# EAGLE design schema (EAGLE 8.2.1)
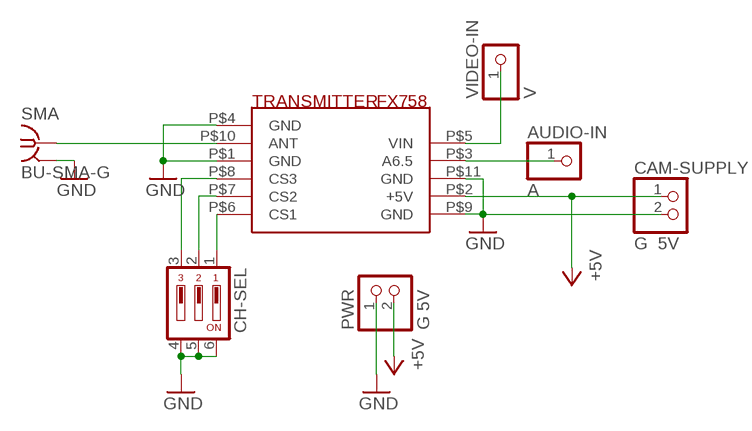
[diagram p0: schematic, sheet 1]

## Parts
AUDIO-IN  A  PINHD-1X1  [1X01]
CAM-SUPPLY  G 5V  PINHD-1X2  [1X02]
CH-SEL  DP03  [DP-03]
PWR  G 5V  PINHD-1X2  [1X02]
SMA  BU-SMA-G  [BU-SMA-G]
TRANSMITTER  FX758  [FX758]
VIDEO-IN  V  PINHD-1X1  [1X01]

## Nets
+5V: CAM-SUPPLY.1 PWR.2 TRANSMITTER.P$2(+5V)
ANTENA: SMA.1 TRANSMITTER.P$10(ANT)
AUDIO-IN: AUDIO-IN.1 TRANSMITTER.P$3(A6.5)
CH1: CH-SEL.1 TRANSMITTER.P$6(CS1)
CH2: CH-SEL.2 TRANSMITTER.P$7(CS2)
CH3: CH-SEL.3 TRANSMITTER.P$8(CS3)
GND: CAM-SUPPLY.2 CH-SEL.4 CH-SEL.5 CH-SEL.6 PWR.1 SMA.2 SMA.3 SMA.4 SMA.5 TRANSMITTER.P$1(GND) TRANSMITTER.P$4(GND) TRANSMITTER.P$9(GND) TRANSMITTER.P$11(GND)
VIDEO-IN: TRANSMITTER.P$5(VIN) VIDEO-IN.1

## Library data of the parts
AUDIO-IN VIDEO-IN = pinhead:PINHD-1X1: PIN HEADER
CAM-SUPPLY PWR = pinhead:PINHD-1X2: PIN HEADER
CH-SEL = switch-dil:DP03: DIL/CODE SWITCH; MPN: MCDP03; OC_FARNELL: 1522004; OC_NEWARK: 74M2976
SMA = con-coax:BU-SMA-G: FEMALE SMA CONNECTOR Radiall distributor RS 193-9117; OC_FARNELL: unknown; OC_NEWARK: unknown
TRANSMITTER = custom-parts:FX758: FX758-2 5.8G 200mW 32CH FPV Wireless Audio Video AV Transmitter Module Factory number: FXT758-2 Voltage: 5V Power: 200mW Frequency: 5725MHz-5945MHz Size: 22x19 mm Modulation type: FM Working temperature: -10℃- +60℃ Transmission frequency group: A: Ch1:5725MHz Ch2:5745MHz Ch3:5765MHz Ch4:5785MHz Ch5:5805MHz Ch6:5825MHz Ch7:5845MHz Ch8:5865MHz B: Ch1:5733MHz Ch2:5752MHz Ch3:5771MHz Ch4:5790MHz Ch5:5809MHz Ch6:5828MHz Ch7:5847MHz Ch8:5866MHz C: Ch1:5645MHz Ch2:5665MHz Ch3:5685MHz Ch4:5705MHz Ch5:5885MHz Ch6:5905MHz Ch7:5925MHz Ch8:5945MHz

## Board
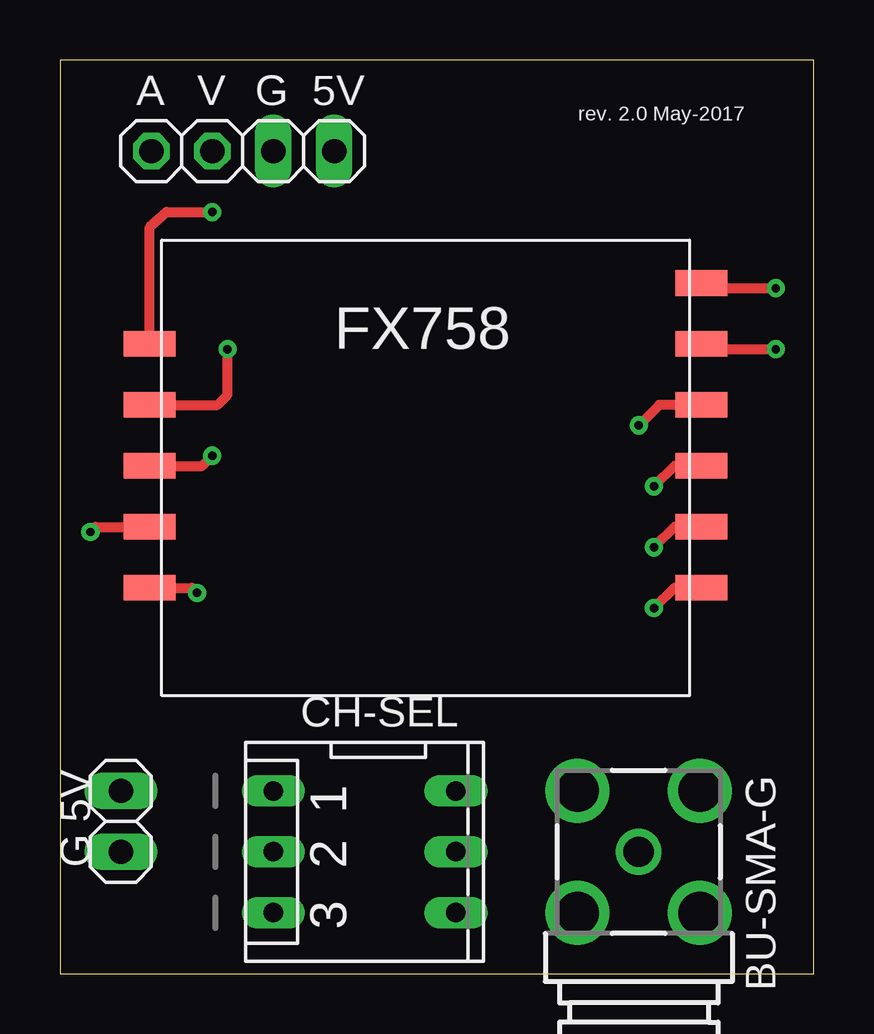
[diagram p1: board, top side]
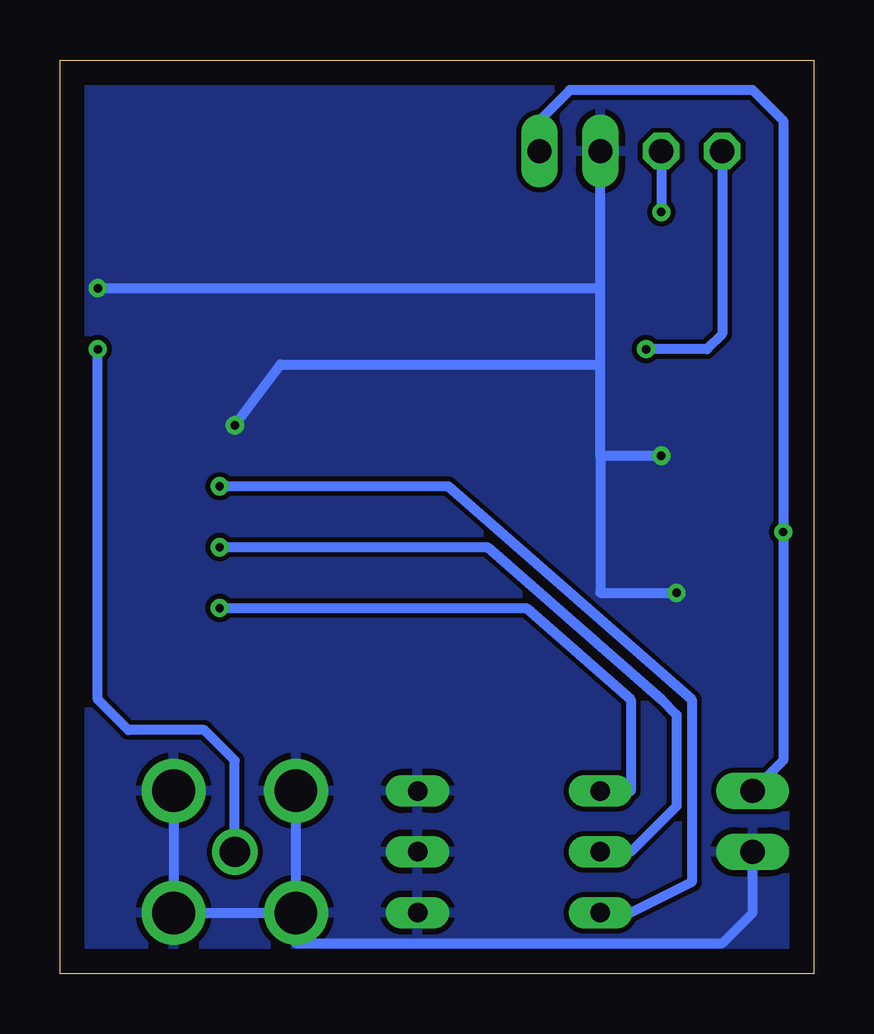
[diagram p2: board, bottom side, seen from below]

Size 31.42 x 38.09 mm. Coordinates in mm from the lower left corner, seen from the top.
Outline: 0,0 31.42,0 31.42,38.09 0,38.09 0,0
Copper layers (1*16): Top 0.035mm / dielectric 1.5mm / Bottom 0.035mm
Design rules "default *": minimum track width 10mil, minimum drill 24mil, track to track 8mil, track to pad 8mil, pad to pad 8mil, via to via 8mil, smd to smd 8mil, copper to edge 40mil, drill to drill 8mil, minimum pad ring 10mil, minimum via ring 8mil, stop-mask expansion 4mil, vias tented up to drill 14mil, thermal gap 10mil

### Footprints (pad centres in the part's own frame; a part is rotated, then mirrored left to right if it is on the bottom)
1X01 = drill 1.016 octagon: 1 0,0
1X02 = drill 1.016 long: 1 -1.27,0; 2 1.27,0
DP-03 = drill 0.813 long: 1 -2.54,-3.81; 2 0,-3.81; 3 2.54,-3.81; 4 2.54,3.81; 5 0,3.81; 6 -2.54,3.81
BU-SMA-G = drill 1.27: 1 0,0 | drill 1.778: 2 -2.55,2.55; 3 2.55,2.55; 4 2.55,-2.55; 5 -2.55,-2.55
FX758 = smd 2.184 x 1.067: P$1 -11.5,-5.5; P$2 -11.5,-2.96; P$3 -11.5,2.12; P$4 -11.5,-0.42; P$5 -11.5,4.66; P$6 11.5,-5.5; P$7 11.5,-2.96; P$8 11.5,-0.42; P$9 11.5,2.12; P$10 11.5,4.66; P$11 11.5,7.2

### Placement (x,y rotation side)
AUDIO-IN  3.81,34.29 0 top
CAM-SUPPLY  10.16,34.29 180 top
CH-SEL  12.7,5.08 270 top
PWR  2.54,6.35 90 top
SMA  24.13,5.08 270 top
TRANSMITTER  15.24,21.59 0 top
VIDEO-IN  6.35,34.29 0 top

### Tracks (layer width: path | path; a pad name or v marks a point on that pad's centre or on a via)
+5V  (via drill 0.35)
  Top 0.406: TRANSMITTER.P$2 1.49,18.63 v1.27,18.41
  Bottom 0.406: CAM-SUPPLY.1 11.43,35.56 10.16,36.83 2.54,36.83 1.27,35.56 v1.27,18.41 1.27,8.89 PWR.2
ANTENA  (via drill 0.35)
  Top 0.406: 26.74,26.04 26.25,26.04 | 26.74,26.04 v29.84,26.04 | TRANSMITTER.P$10 26.74,26.04
  Bottom 0.406: SMA.1 24.13,8.89 25.4,10.16 28.57,10.16 29.84,11.43 v29.84,26.04
AUDIO-IN  (via drill 0.35)
  Top 0.406: v6.99,26.04 6.99,24.13 6.57,23.71 TRANSMITTER.P$3
  Bottom 0.406: AUDIO-IN.1 3.81,26.67 4.45,26.04 v6.99,26.04
CH1  (via drill 0.35)
  Top 0.406: TRANSMITTER.P$6 25.61,16.09 v24.77,15.24
  Bottom 0.406: v24.77,15.24 11.97,15.24 7.62,11.43 7.62,7.62 CH-SEL.1
CH2  (via drill 0.35)
  Top 0.406: TRANSMITTER.P$7 25.61,18.63 v24.77,17.78
  Bottom 0.406: v24.77,17.78 13.61,17.78 6.35,11.43 5.71,10.79 5.71,6.99 7.62,5.08 CH-SEL.2
CH3  (via drill 0.35)
  Top 0.406: TRANSMITTER.P$8 25.61,21.17 v24.77,20.32
  Bottom 0.406: v24.77,20.32 15.24,20.32 5.08,11.43 5.08,3.81 7.62,2.54 CH-SEL.3
GND  (via drill 0.35)
  Top 0.406: v29.84,28.57 27.09,28.57 26.88,28.79 TRANSMITTER.P$11 | TRANSMITTER.P$1 5.5,16.09 v5.71,15.88 | TRANSMITTER.P$9 24.98,23.71 v24.13,22.86 | TRANSMITTER.P$4 5.93,21.17 v6.35,21.59
  Bottom 0.406: SMA.2 SMA.3 SMA.4 | SMA.4 SMA.5 | SMA.4 21.58,1.27 3.81,1.27 2.54,2.54 PWR.1 | 8.89,28.57 CAM-SUPPLY.2 | 8.89,25.4 8.89,28.57 | 8.89,21.59 8.89,25.4 | 8.89,21.59 8.89,15.88 v5.71,15.88 | v29.84,28.57 8.89,28.57 | v24.13,22.86 22.23,25.4 8.89,25.4 | v6.35,21.59 8.89,21.59
  pour Bottom: 0,38.1 31.75,38.1 31.75,-1.27 0,-1.27
VIDEO-IN  (via drill 0.35)
  Top 0.406: v6.35,31.75 4.45,31.75 3.74,31.11 TRANSMITTER.P$5
  Bottom 0.406: VIDEO-IN.1 v6.35,31.75

### Text on the board
tNames: rev. 2.0 May-2017 | FX758